# EAGLE design EAGLESSTC2 (EAGLE 9.1.3)
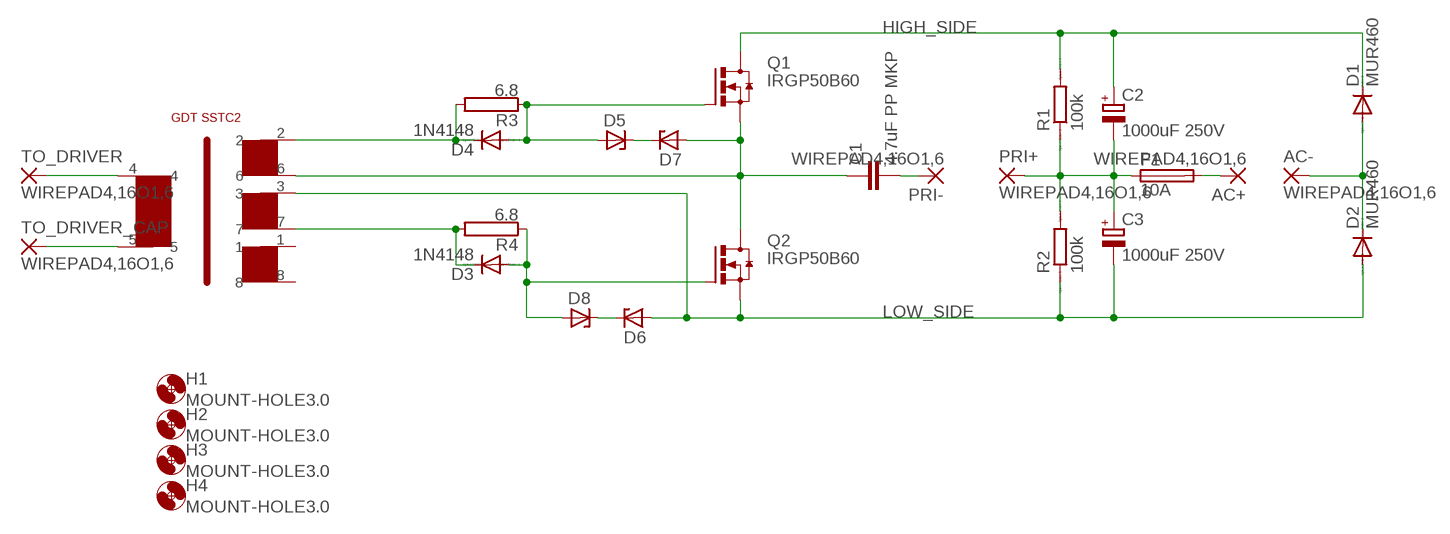
[diagram p0: schematic, sheet 1]

## Parts
AC+  WIREPAD4,16O1,6  [4,16O1,6]
AC-  WIREPAD4,16O1,6  [4,16O1,6]
C1  4.7uF PP MKP  C37/20  [C37.5B20]
C2  1000uF 250V  CPOL-EUE10-35  [EB35D]
C3  1000uF 250V  CPOL-EUE10-35  [EB35D]
D1  MUR460  MUR440RL  [C2673]
D2  MUR460  MUR440RL  [C2673]
D3  1N4148  1N4148DO35-10  [DO35-10]
D4  1N4148  1N4148DO35-10  [DO35-10]
D5  ZENER-DIODEZD-10  [ZDIO-10]
D6  ZENER-DIODEZD-10  [ZDIO-10]
D7  ZENER-DIODEZD-10  [ZDIO-10]
D8  ZENER-DIODEZD-10  [ZDIO-10]
F1  10A  FUSESH22  [SH22]
H1  MOUNT-HOLE3.0  [3,0]
H2  MOUNT-HOLE3.0  [3,0]
H3  MOUNT-HOLE3.0  [3,0]
H4  MOUNT-HOLE3.0  [3,0]
PRI+  WIREPAD4,16O1,6  [4,16O1,6]
PRI-  WIREPAD4,16O1,6  [4,16O1,6]
Q1  IRGP50B60  IRFP250  [TO-247AD-V]
Q2  IRGP50B60  IRFP250  [TO-247AD-V]
R1  100k  R0207/10  [0207/10]
R2  100k  R0207/10  [0207/10]
R3  6.8  RRWM6X22  [RWM6X22]
R4  6.8  RRWM6X22  [RWM6X22]
TO_DRIVER  WIREPAD4,16O1,6  [4,16O1,6]
TO_DRIVER_CAP  WIREPAD4,16O1,6  [4,16O1,6]
U$1  ATX-TRANSFORMER_01  [ATX-TRANSFORMER_01]

## Nets
CAP_TO_GDT: TO_DRIVER_CAP.1(P) U$1.5
DRIVER_PIN7: TO_DRIVER.1(P) U$1.4
HIGH_SIDE [power]: C2.+ D1.C Q1.D R1.2
LOW_SIDE: C3.- D2.A D6.A Q2.S R2.1 U$1.3
N$1: C1.1 D7.A Q1.S Q2.D U$1.6
N$3 [power]: C1.2 PRI-.1(P)
N$6: AC+.1(P) F1.2
N$7: D6.C D8.C
N$8: D5.C D7.C
N$9: AC-.1(P) D1.A D2.C
N$11: D3.C R4.2 U$1.7
N$12: C2.- C3.+ F1.1 PRI+.1(P) R1.1 R2.2
N$13: D4.C R3.2 U$1.2
N$14: D4.A D5.A Q1.G R3.1
N$15: D3.A D8.A Q2.G R4.1
Unconnected: U$1.1 U$1.8

## Library data of the parts
AC+ AC- PRI+ PRI- TO_DRIVER TO_DRIVER_CAP = wirepad:WIREPAD: Wire PAD connect wire on PCB
C1 = capacitor-wima:C: CAPACITOR naming: grid - package width
C2 C3 = rcl:CPOL-EU: POLARIZED CAPACITOR, European symbol; SPICEPREFIX: C
D1 D2 = diode:MUR440RL: DIODE ultra-fast recovery rectifier, Vrrm = 40 V, 4 A
D3 D4 = diode:1N4148: DIODE high speed (Philips)
D5-D8 = diode:ZENER-DIODE: Z-Diode
F1 = fuse:FUSE: Fuse; OC_FARNELL: unknown; OC_NEWARK: unknown
H1-H4 = holes:MOUNT-HOLE: MOUNTING HOLE with drill center marker
Q1 Q2 = transistor-power:IRFP25*: 33A/27A, 200V/150V, 0.085/0.012 Ohm, N-Channel Power MOSFET Source: Fairchild Semiconductor Corporation
R1 R2 = eagle-ltspice:R: RESISTOR, European symbol; SPICEMODEL: NONE; SPICEPREFIX: R
R3 R4 = resistor-power:R: Power Resitor; OC_FARNELL: unknown; OC_NEWARK: unknown
U$1 = my-library:ATX-TRANSFORMER_01

## Net classes
1 power: width 2.54 mm

## Board
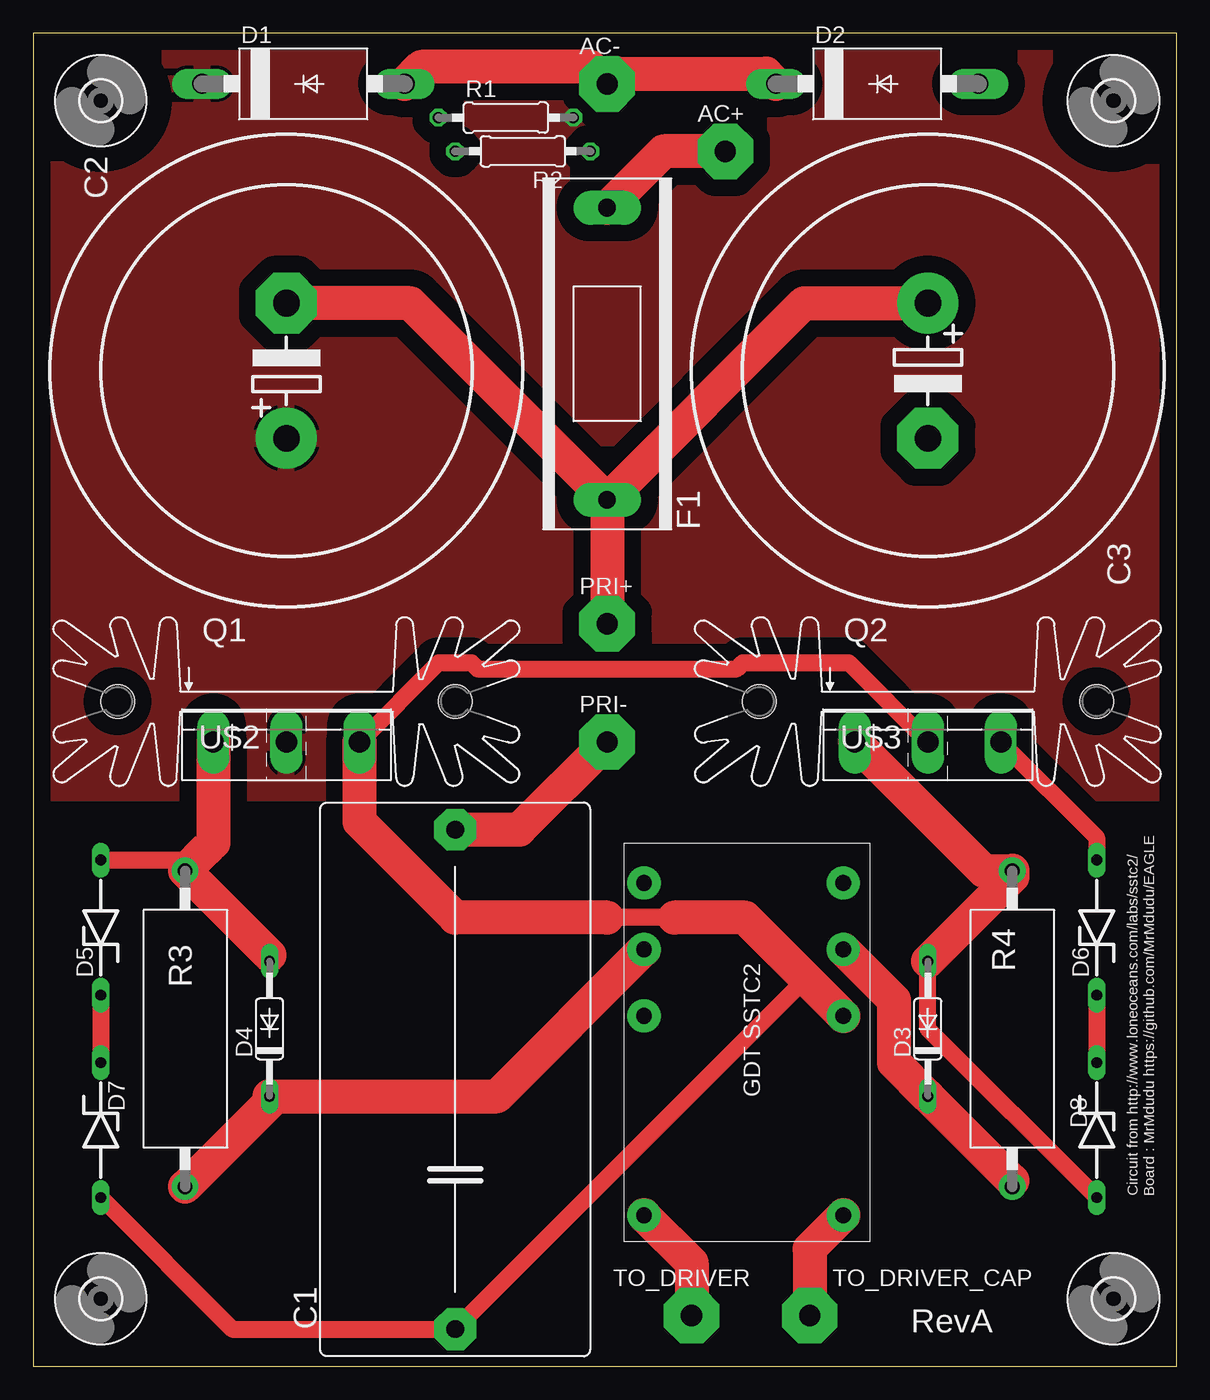
[diagram p1: board, top side]
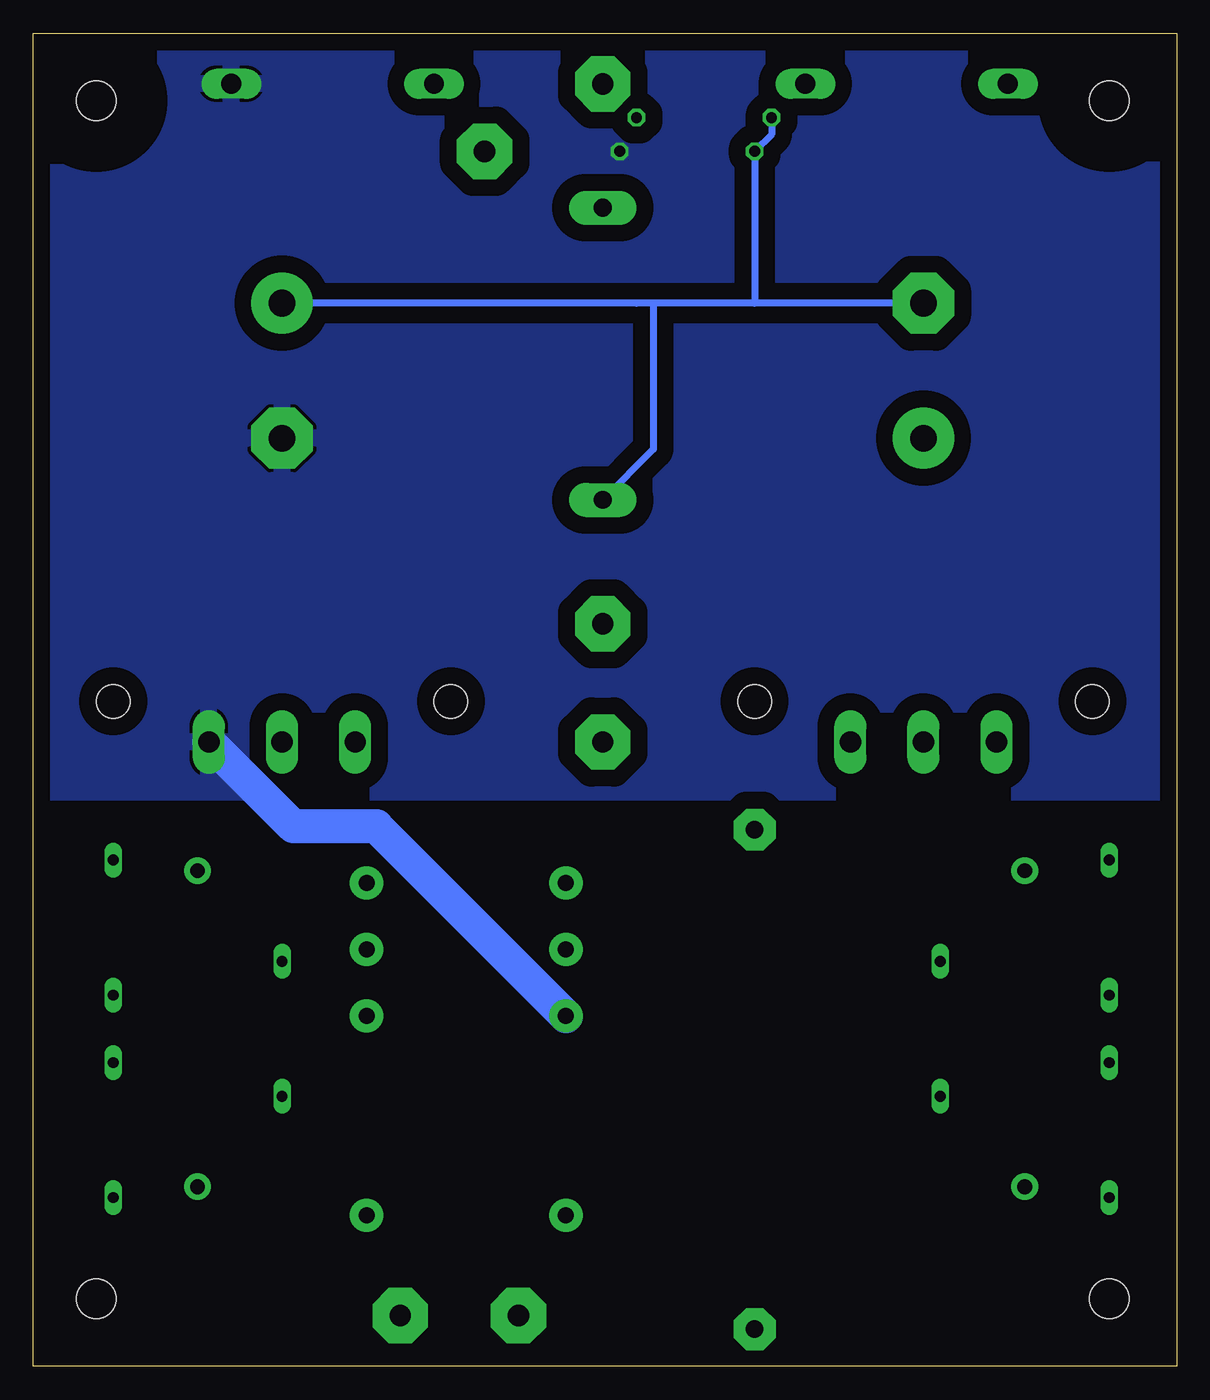
[diagram p2: board, bottom side, seen from below]

Size 86.03 x 100.32 mm. Coordinates in mm from the lower left corner, seen from the top.
Outline: 0,0 86.03,0 86.03,100.32 0,100.32 0,0
Copper layers (1*16): Top 0.035mm / dielectric 1.5mm / Bottom 0.035mm
Design rules "default": minimum track width 6mil, minimum drill 0.35mm, track to track 6mil, track to pad 6mil, pad to pad 6mil, via to via 6mil, smd to smd 6mil, copper to edge 40mil, drill to drill 6mil, minimum pad ring 10mil, minimum via ring 8mil, stop-mask expansion 4mil, vias tented up to drill 0mil, thermal gap 10mil

### Footprints (pad centres in the part's own frame; a part is rotated, then mirrored left to right if it is on the bottom)
4,16O1,6 = drill 1.6 pad 4.166 octagon: 1 0,0
C37.5B20 = drill 1.321 pad 3.15 octagon: 1 -18.796,0; 2 18.796,0
EB35D = drill 2.007 pad 4.597: + -5.08,0 | drill 2.007 pad 4.597 octagon: - 5.08,0
C2673 = drill 1.499 long: A 7.62,0; C -7.62,0
DO35-10 = drill 0.813 long: A 5.08,0; C -5.08,0
ZDIO-10 = drill 0.813 long: A 5.08,0; C -5.08,0
SH22 = drill 1.321 pad 2.54 long: 1 -10.998,0; 2 10.998,0
3,0 = hole 3: 0,0
TO-247AD-V = drill 1.6 long: D 0,-2.54; G -5.5,-2.54; S 5.5,-2.54
0207/10 = drill 0.813 octagon: 1 -5.08,0; 2 5.08,0
RWM6X22 = drill 1.1 pad 2: 1 -11.89,0; 2 11.89,0
ATX-TRANSFORMER_01 = drill 1.2 pad 2.5: 1 3,1.5; 2 8,1.5; 3 13,1.5; 4 28,1.5; 5 28,16.5; 6 13,16.5; 7 8,16.5; 8 3,16.5
SK104 = hole 2.54: -12.7,-0.762; 12.7,-0.762

### Placement (x,y rotation side)
AC+  52.07,91.44 0 top
AC-  43.18,96.52 0 top
C1  31.75,21.59 90 top
C2  19.05,74.93 90 top
C3  67.31,74.93 270 top
D1  20.32,96.52 0 top
D2  63.5,96.52 0 top
D3  67.31,25.4 90 top
D4  17.78,25.4 90 top
D5  5.08,33.02 90 top
D6  80.01,33.02 90 top
D7  5.08,17.78 270 top
D8  80.01,17.78 270 top
F1  43.18,76.2 90 top
H1  5.08,5.08 0 top
H2  81.28,5.08 0 top
H3  81.28,95.25 0 top
H4  5.08,95.25 0 top
PRI+  43.18,55.88 0 top
PRI-  43.18,46.99 0 top
Q1  19.05,49.53 0 top
Q2  67.31,49.53 0 top
R1  35.56,93.98 0 top
R2  36.83,91.44 180 top
R3  11.43,25.4 270 top
R4  73.66,25.4 270 top
TO_DRIVER  49.53,3.81 0 top
TO_DRIVER_CAP  58.42,3.81 0 top
U$1  44.45,39.37 270 top
U$2  [SK104]  19.05,50.8 0 top
U$3  [SK104]  67.31,50.8 0 top

### Tracks (layer width: path | path; a pad name or v marks a point on that pad's centre or on a via)
CAP_TO_GDT
  Top 2.54: U$1.5 58.42,8.84 TO_DRIVER_CAP.1
DRIVER_PIN7
  Top 2.54: U$1.4 49.53,7.79 TO_DRIVER.1
HIGH_SIDE
  pour Top (isolate 1.27): -1.27,104.14 -1.27,43.18 87.63,43.18 87.63,104.14
LOW_SIDE
  Top 1.27: Q2.S 80.01,39.79 D6.A
  Bottom 2.54: U$1.3 60.22,40.64 66.46,40.64 Q2.S
  pour Bottom (isolate 1.27): -1.27,104.14 -1.27,43.18 87.63,43.18 87.63,104.14
N$1
  Top 1.27: D7.A 14.99,2.79 C1.1 58.01,29.05 58.27,29.05 | U$1.6 58.27,29.05 | 53.54,33.78 58.27,29.05 | 48.26,33.78 43.18,33.78 | Q1.S 30.52,52.96 32.96,52.96 33.43,52.48 52.93,52.48 53.4,52.96 61.34,52.96 Q2.D
  Top 2.54: Q1.S 24.55,40.98 31.75,33.78 43.18,33.78 | U$1.6 53.54,33.78 48.26,33.78
N$3
  Top 2.54: C1.2 36.58,40.39 PRI-.1
N$6
  Top 2.54: AC+.1 47.42,91.44 F1.2
N$7
  Top 1.27: D6.C D8.C
N$8
  Top 1.27: D5.C D7.C
N$9
  Top 2.54: D1.A 29.21,97.79 41.91,97.79 AC-.1 43.94,97.28 55.12,97.28 D2.C
N$11
  Top 1.27: 73.66,13.97 R4.2
  Top 2.54: 73.66,13.97 D3.C 64.77,22.86 64.77,27.55 U$1.7
N$12
  Top 2.54: F1.1 PRI+.1 | F1.1 57.99,80.01 C3.+ | F1.1 28.37,80.01 C2.-
  Bottom 0.508: 39.37,80.01 39.37,69.01 F1.1 | C2.- 31.75,80.01 | 31.75,80.01 39.37,80.01 | C3.+ 40.64,80.01 39.37,80.01 | R1.1 30.48,92.71 R2.2 31.75,80.01
N$13
  Top 2.54: R3.2 17.78,19.86 D4.C 34.9,20.32 U$1.2
N$14
  Top 1.27: D5.A 11.43,38.1 R3.1 | 13.55,39.41 13.11,38.97 | 17.78,30.94 D4.A
  Top 2.54: Q1.G 13.55,39.41 | 13.11,38.97 R3.1 17.78,30.94
N$15
  Top 1.27: D8.A 67.31,25.4 D3.A | 73.66,36.83 R4.1
  Top 2.54: Q2.G 71.51,37.29 R4.1 73.66,36.83 D3.A

### Text on the board
tPlace: Circuit from http://www.loneoceans.com/labs/sstc2/ / Board : MrMdudu https://github.com/MrMdudu/EAGLE | RevA